# Altium schematic sheet FPGAGTP.SchDoc: =ProjectName
size 420 x 297 mm; Author: Paweł Kulik; CompanyName: WUT; DrawnBy: Paweł Kulik; Organization: WUT ISE; Address1: Warsaw Univeristy of Technology; Address2: Nowowiejska 15/19; DocumentNumber: 10; Revision: 2.0.1; SheetNumber: 4; SheetTotal: 11; EDA_Number: ARTIQ; Projet: ARTIQ/SINARA; ModifiedBy: -; CheckedDate: -; Title2: FPGAGTP.SchDoc; DivGrp: ISE; Designer: Paweł Kulik; ModifiedDate: -; ProjectName: ARTIQ/SINARA
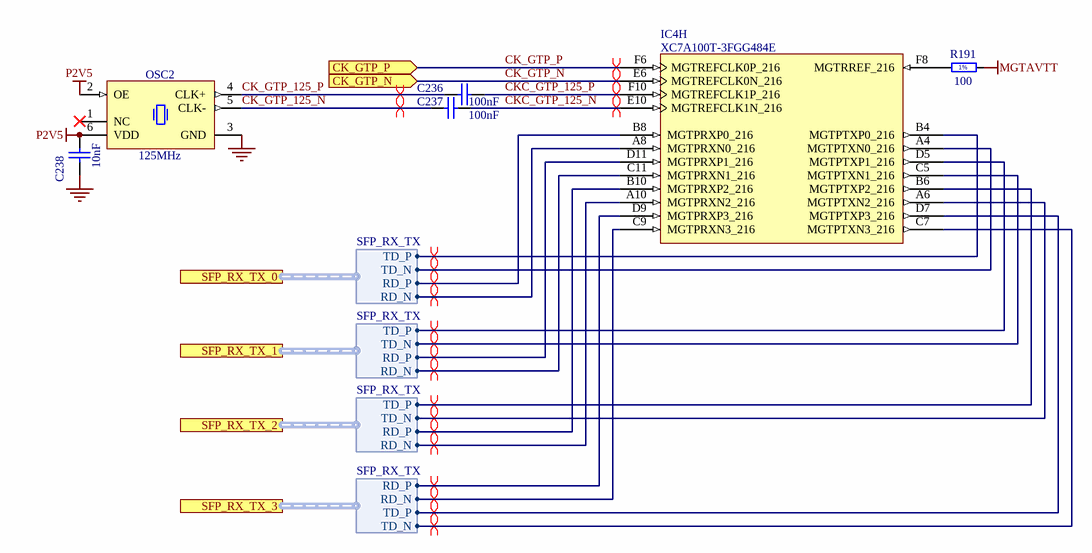
[diagram p0: FPGAGTP.SchDoc]

## Parts
C236  100nF  [CAPC0603X33N]
C237  100nF  [CAPC0603X33N]
C238  10nF  [CAPC1005X55N]
IC4  XC7A100T-3FGG484E  [BGA484C100P22X22_2300X2300X260]  (part H of 10)
OSC2  125MHz  [OSC_SILICON-LAB_SI510-6N]
R191  100  [RESC1005X40N]

## Ports
CK_GTP_N (in), CK_GTP_P (in), SFP_RX_TX_0 (harness SFP_RX_TX), SFP_RX_TX_1 (harness SFP_RX_TX), SFP_RX_TX_2 (harness SFP_RX_TX), SFP_RX_TX_3 (harness SFP_RX_TX)

## Harnesses
SFP_RX_TX: RD_N, RD_P, TD_N, TD_P

## Nets
GND: C238.1 OSC2.3(GND)
MGTAVTT: R191.1
P2V5: C238.2 OSC2.2(OE) OSC2.6(VDD)
CK_GTP_125_N: C237.1 OSC2.5(CLK-)
CK_GTP_125_P: C236.1 OSC2.4(CLK+)
CK_GTP_N: IC4.E6(MGTREFCLK0N_216) ; port CK_GTP_N
CK_GTP_P: IC4.F6(MGTREFCLK0P_216) ; port CK_GTP_P
CKC_GTP_125_N: C237.2 IC4.E10(MGTREFCLK1N_216)
CKC_GTP_125_P: C236.2 IC4.F10(MGTREFCLK1P_216)
NetIC4_A4: IC4.A4(MGTPTXN0_216) ; port SFP_RX_TX_0.TD_N
NetIC4_A6: IC4.A6(MGTPTXN2_216) ; port SFP_RX_TX_2.TD_N
NetIC4_A8: IC4.A8(MGTPRXN0_216) ; port SFP_RX_TX_0.RD_N
NetIC4_A10: IC4.A10(MGTPRXN2_216) ; port SFP_RX_TX_2.RD_N
NetIC4_B4: IC4.B4(MGTPTXP0_216) ; port SFP_RX_TX_0.TD_P
NetIC4_B6: IC4.B6(MGTPTXP2_216) ; port SFP_RX_TX_2.TD_P
NetIC4_B8: IC4.B8(MGTPRXP0_216) ; port SFP_RX_TX_0.RD_P
NetIC4_B10: IC4.B10(MGTPRXP2_216) ; port SFP_RX_TX_2.RD_P
NetIC4_C5: IC4.C5(MGTPTXN1_216) ; port SFP_RX_TX_1.TD_N
NetIC4_C7: IC4.C7(MGTPTXN3_216) ; port SFP_RX_TX_3.TD_N
NetIC4_C9: IC4.C9(MGTPRXN3_216) ; port SFP_RX_TX_3.RD_N
NetIC4_C11: IC4.C11(MGTPRXN1_216) ; port SFP_RX_TX_1.RD_N
NetIC4_D5: IC4.D5(MGTPTXP1_216) ; port SFP_RX_TX_1.TD_P
NetIC4_D7: IC4.D7(MGTPTXP3_216) ; port SFP_RX_TX_3.TD_P
NetIC4_D9: IC4.D9(MGTPRXP3_216) ; port SFP_RX_TX_3.RD_P
NetIC4_D11: IC4.D11(MGTPRXP1_216) ; port SFP_RX_TX_1.RD_P
NetIC4_F8: IC4.F8(MGTRREF_216) R191.2

Not connected (* = marked no-connect by the designer): OSC2 1(NC)*

## Layout directives
differential pair; differential pair class Diff_100Ohm; differential pair class GTP: NetIC4_A4, NetIC4_A6, NetIC4_A8, NetIC4_A10, NetIC4_B4, NetIC4_B6, NetIC4_B8, NetIC4_B10, NetIC4_C5, NetIC4_C7, NetIC4_C9, NetIC4_C11, NetIC4_D5, NetIC4_D7, NetIC4_D9, NetIC4_D11
differential pair; differential pair class LVPECL: CK_GTP_N, CK_GTP_P
differential pair; differential pair class Diff_100Ohm: CK_GTP_125_N, CK_GTP_125_P, CKC_GTP_125_N, CKC_GTP_125_P

## Notes on the sheet
- Project/Equipment
- Document
- Designer
- Drawn by
- Check.by
- Copyright WUT 2022.
  This documentation describes Open Hardware and is licensed under the CERN OHL v. 1.2. You may redistribute and modify this documentation under the terms of the CERN OHL v.1.2. (http://ohwr.org/cernohl). This documentation is distributed WITHOUT ANY EXPRESS OR IMPLIED WARRANTY, INCLUDING OF MERCHANTABILITY, SATISFACTORY QUALITY AND FITNESS FOR A PARTICULAR PURPOSE. Please see the CERN OHL v.1.2 for applicable conditions
- File
- Last Mod.
- Print Date
- Sheet
- Size
- A3
- of
- Rev
- (in symbol R0402_100R_1%_0.0625W_100PPM) 1%

## Library data of the parts
C236 C237 = CC0201_100NF_6.3V_10%_X5R: Non-polarised capacitor; Part Description: SMD Multilayer Chip Ceramic Capacitor; Manufacturer: GENERIC; Manufacturer1 Part Number: 02016D104KAT2A; Voltage: 6.3V; TC: X5R; Tolerance: ±10%; Part Number: CC0201_100NF_6.3V_10%_X5R; Component Kind: Standard; Component Type: Standard; Pin Count: 2; Value: 100nF; Status: Not Recommended; Manufacturer Part Number: CC0201_100NF_6.3V_10%_X5R; Case: 0201; Mounted: Yes; Socket: No; SMD: Yes; Sense: No; Manufacturer1 Example: AVX; Manufacturer1 ComponentHeight: 0.33mm; HelpURL: \\cern.ch\dfs\Applications\Altium\Datasheets\CC0201_X5R_AVX.pdf; Author: CERN DEM JLC; CreateDate: 2007-12-03; LatestRevisionDate: 2007-12-03
C238 = CC0402_10NF_16V_10%_X7R: Non-polarised capacitor; Part Description: SMD Multilayer Chip Ceramic Capacitor; Manufacturer: GENERIC; Manufacturer1 Part Number: 223878715636; Voltage: 16V; TC: X7R; Tolerance: ±10%; Part Number: CC0402_10NF_16V_10%_X7R; Component Kind: Standard; Component Type: Standard; Pin Count: 2; Value: 10nF; Status: Not Recommended; Manufacturer Part Number: CC0402_10NF_16V_10%_X7R; Case: 0402; Mounted: Yes; Socket: No; SMD: Yes; Sense: No; Manufacturer1 Example: PHYCOMP; Manufacturer1 ComponentHeight: 0.55mm; HelpURL: \\cern.ch\dfs\Applications\Altium\Datasheets\CC0402_X7R_PHYCOMP.pdf; Author: CERN DEM JLC; CreateDate: 03.12.2007; LatestRevisionDate: 03.12.2007
IC4 = XC7A100T-3FGG484E: Artix-7 FPGA, 285 User I/Os, 4 GTP, 484-Ball BGA, Speed Grade 3, Extended Temperature Grade, Pb-Free; Manufacturer: XILINX; PressFit: No; Bonding: No; PackageDescription: BGA, 1.00mm Pitch, Square; 484 Pin, 22 Columns X 22 Rows, Body 23.00mm X 23.00mm X 2.60mm H, IPC Medium Density; ComponentLink2Description: Pinout; ComponentLink2URL: \\cern.ch\dfs\Applications\Altium\Datasheets\XC7A100T-3FGG484E_Pinout.pdf; ComponentLink1URL: \\cern.ch\dfs\Applications\Altium\Datasheets\XC7A100T-3FGG484E_Package-Pinout.pdf; ComponentLink1Description: Package/Pinout; Part Number: XC7A100T-3FGG484E; Component Kind: Standard; Component Type: Standard; Device: XC7A100T-3FGG484E; Part Description: Artix-7 FPGA, 285 User I/Os, 4 GTP, 484-Ball BGA, Speed Grade 3, Extended Temperature Grade, Pb-Free; Manufacturer Part Number: XC7A100T-3FGG484E; Pin Count: 484; Case: BGA484; Mounted: Yes; Socket: No; SMD: Yes; Sense: No; ComponentHeight: 2.6mm; HelpURL: \\cern.ch\dfs\Applications\Altium\Datasheets\XC7A100T-3FGG484E.pdf; Author: CERN DEM BC; CreateDate: 18.10.2019; LatestRevisionDate: 18.10.2019
OSC2 = OSC_125MHZ_SILICON-LAB_510FBA125M000AAG: Crystal Oscillator 6 pins, Si510 (LVDS/LVPECL/HCSL/Dual CMOS); Part Description: 2.5V ±25ppm LVDS Crystal Oscillator (XO), Si510 Series; Manufacturer: SILICON LABS; PressFit: No; Bonding: No; Part Number: OSC_125MHZ_SILICON-LAB_510FBA125M000AAG; Component Kind: Standard; Component Type: Standard; PackageDescription: Oscillator Si510 Series, 6 pins, 5x7mm; Value: 125MHz; Manufacturer Part Number: 510FBA125M000AAG; Pin Count: 6; Mounted: Yes; Socket: No; SMD: Yes; Sense: No; ComponentHeight: 1.8mm; HelpURL: \\cern.ch\dfs\Applications\Altium\Datasheets\OSC_SILICON-LAB_SI510.pdf; Author: CERN DEM JMW; CreateDate: 2015-08-10; LatestRevisionDate: 2015-08-10
R191 = R0402_100R_1%_0.0625W_100PPM: Resistor - 1%; Part Description: General Purpose Thick Film Chip Resistor; Manufacturer: GENERIC; Manufacturer1 Part Number: 232270671001L; TC: ±100ppm/°C; PressFit: No; Part Number: R0402_100R_1%_0.0625W_100PPM; Component Kind: Standard; Component Type: Standard; Pin Count: 2; Value: 100; Status: Not Recommended; Power: 0.0625W; Tolerance: ±1%; Manufacturer Part Number: R0402_100R_1%_0.0625W_100PPM; Case: 0402; Mounted: Yes; Sense: No; Socket: No; SMD: Yes; Manufacturer1 Example: YAGEO PHYCOMP; Manufacturer1 ComponentHeight: 0.4mm; HelpURL: \\cern.ch\dfs\Applications\Altium\Datasheets\R0402_Phycomp_RC0402.pdf; Author: CERN DEM JLC; CreateDate: 03.12.2007; LatestRevisionDate: 17.10.2012; ClassName: Artix